# Altium project TAS5828M_Audio_Amp.PrjPcb
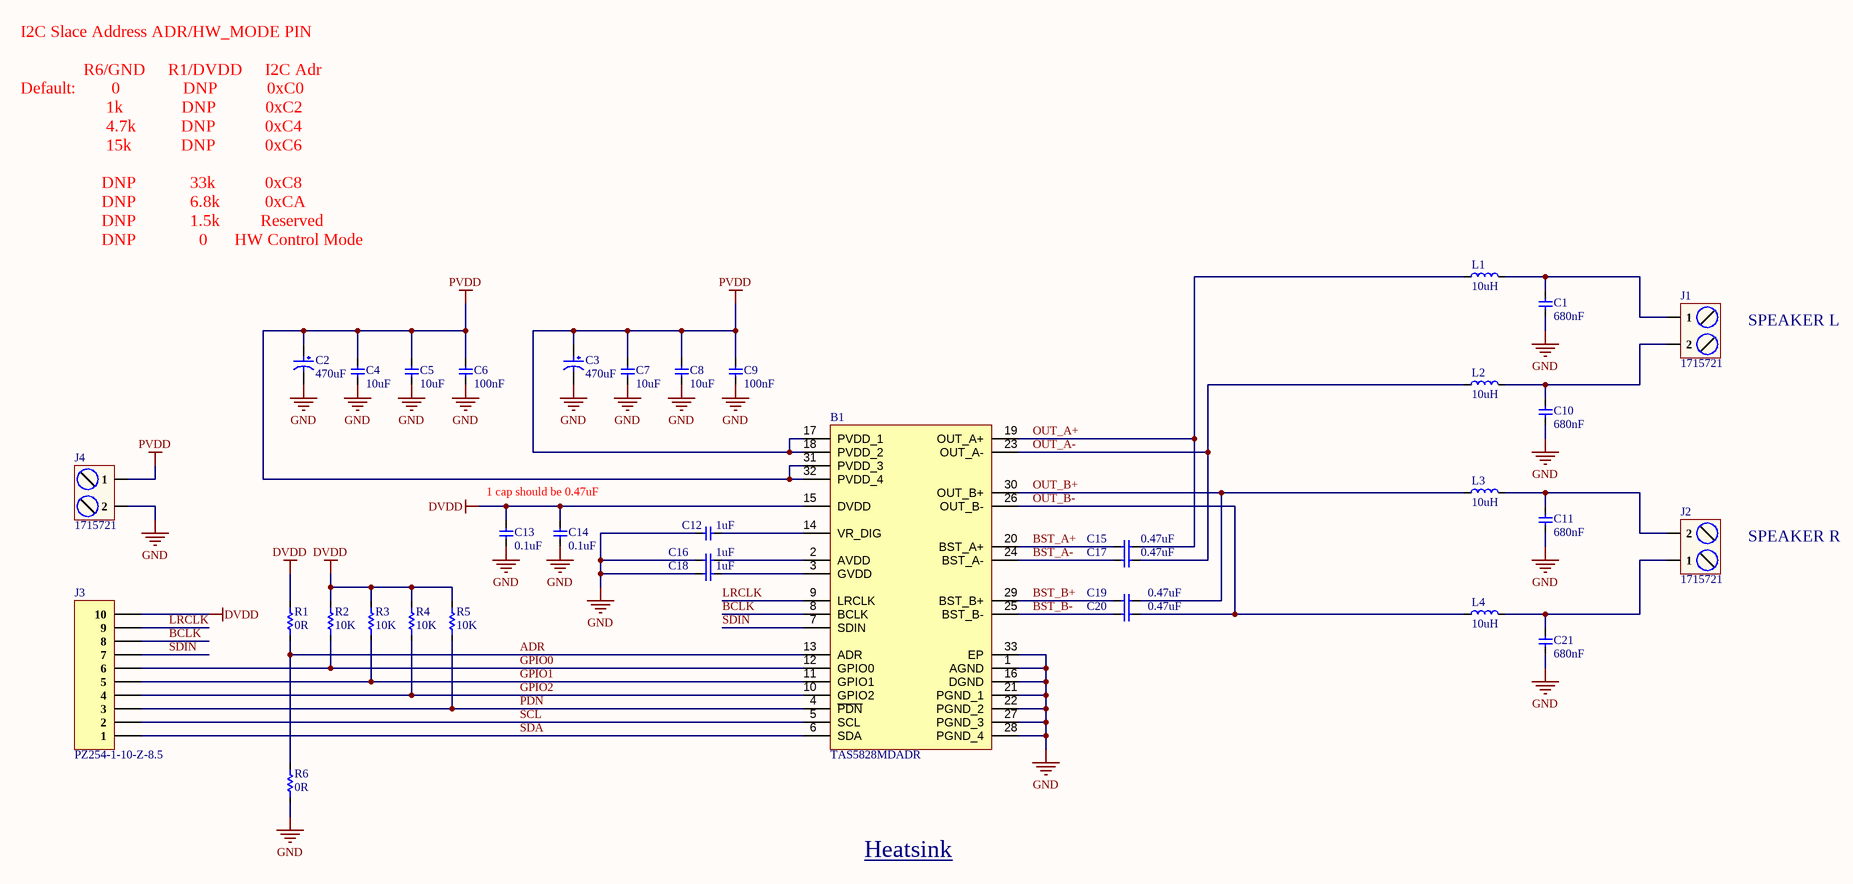
[diagram p0: Sheet1.SchDoc]
1 sheet, 36 parts. Net scope: global (net labels, ports and power ports of the same name join across sheets).
Board file: PCB.PcbDoc

## Sheet Sheet1.SchDoc
size 420 x 297 mm; SheetNumber: 1; SheetTotal: 1

### Parts
B1  TAS5828MDADR  [SOP65P810X115-33M]
C1  680nF  [Cap-0805]
C2  470uF  [RVT470UF50V34RV0133]
C3  470uF  [RVT470UF50V34RV0133]
C4  10uF  [Cap-0805]
C5  10uF  [Cap-0805]
C6  100nF  [Cap-0603]
C7  10uF  [Cap-0805]
C8  10uF  [Cap-0805]
C9  100nF  [Cap-0603]
C10  680nF  [Cap-0805]
C11  680nF  [Cap-0805]
C12  1uF  [Cap-0603]
C13  0.1uF  [Cap-0402]
C14  0.1uF  [Cap-0402]
C15  0.47uF  [Cap-0603]
C16  1uF  [Cap-0603]
C17  0.47uF  [Cap-0603]
C18  1uF  [Cap-0603]
C19  0.47uF  [Cap-0603]
C20  0.47uF  [Cap-0603]
C21  680nF  [Cap-0805]
J1  1715721  [1715721]
J2  1715721  [1715721]
J3  PZ254-1-10-Z-8.5  [PZ254-1-10-Z-8.5]
J4  1715721  [1715721]
L1  10uH  [PSPMAA1040-100M-ANP]
L2  10uH  [PSPMAA1040-100M-ANP]
L3  10uH  [PSPMAA1040-100M-ANP]
L4  10uH  [PSPMAA1040-100M-ANP]
R1  0R  [Res-0402]
R2  10K  [Res-0402]
R3  10K  [Res-0402]
R4  10K  [Res-0402]
R5  10K  [Res-0402]
R6  0R  [Res-0402]

### Nets
DVDD: B1.15(DVDD) C13.2 C14.2 J3.10 R1.2 R2.2 R3.2 R4.2 R5.2
GND: B1.1(AGND) B1.16(DGND) B1.21(PGND_1) B1.22(PGND_2) B1.27(PGND_3) B1.28(PGND_4) B1.33(EP) C1.1 C2.2 C3.2 C4.1 C5.1 C6.1 C7.1 C8.1 C9.1 C10.1 C11.1 C12.1 C13.1 C14.1 C16.1 C18.1 C21.1 J4.2 R6.1
PVDD: B1.17(PVDD_1) B1.18(PVDD_2) B1.31(PVDD_3) B1.32(PVDD_4) C2.1 C3.1 C4.2 C5.2 C6.2 C7.2 C8.2 C9.2 J4.1
ADR: B1.13(ADR) R1.1 R6.2
BCLK: B1.8(BCLK) J3.8
BST_A+: B1.20(BST_A+) C15.1
BST_A-: B1.24(BST_A-) C17.1
BST_B+: B1.29(BST_B+) C19.1
BST_B-: B1.25(BST_B-) C20.1
GPIO0: B1.12(GPIO0) J3.6 R2.1
GPIO1: B1.11(GPIO1) J3.5 R3.1
GPIO2: B1.10(GPIO2) J3.4 R4.1
LRCLK: B1.9(LRCLK) J3.9
OUT_A+: B1.19(OUT_A+) C15.2 L1.1
OUT_A-: B1.23(OUT_A-) C17.2 L2.1
OUT_B+: B1.30(OUT_B+) C19.2 L3.1
OUT_B-: B1.26(OUT_B-) C20.2 L4.1
PDN: B1.4(~{PDN}) J3.3 R5.1
SCL: B1.5(SCL) J3.2
SDA: B1.6(SDA) J3.1
SDIN: B1.7(SDIN) J3.7
NetB1_2: B1.2(AVDD) C16.2
NetB1_3: B1.3(GVDD) C18.2
NetB1_14: B1.14(VR_DIG) C12.2
NetC1_2: C1.2 J1.1 L1.2
NetC10_2: C10.2 J1.2 L2.2
NetC11_2: C11.2 J2.2 L3.2
NetC21_2: C21.2 J2.1 L4.2

### Notes on the sheet
- I2C Slace Address ADR/HW_MODE PIN
  R6/GND     R1/DVDD     I2C Adr
  Default:        0              DNP           0xC0
  1k             DNP           0xC2
  4.7k          DNP           0xC4
  15k           DNP           0xC6
  DNP            33k           0xC8
  DNP            6.8k          0xCA
  DNP            1.5k         Reserved
  DNP              0      HW Control Mode
- SPEAKER L
- 1 cap should be 0.47uF
- SPEAKER R
- Heatsink <https://www.lcsc.com/product-detail/Heat-sink-heatsink_XSD-XSD271-294-B_C286198.html>
- THIS DOCUMENT AND THE DATA DISCLOSED HEREIN OR
- HEREWITH IS THE PROPERTY OF ALTIUM LIMITED AND MAY
- DWG NO:
- REVISION
- REV:
- DESCRIPTION
- DATE
- APPROVED
- BE FREELY DISTRIBUTED IN WHOLE. NO RIGHTS ARE
- RESERVED OR EXPRESS OR IMPLIED WARANTEE GIVEN.
- ENG:
- APPROVALS
- PROJECT
- DSN:
- CHK:
- REFERENCE DOCUMENTS
- PROJECT REVISION:
- TITLE
- DOCUMENT REVISION:
- DESIGN ITEM:
- BOM:
- FAB DWG:
- PCB DWG:
- ASSY DWG:
- SCALE:
- A3
- SIZE
- CAGE CODE
- FILE NAME
- DWG NO.
- SHEET
- OF
- REV

### Library data of the parts
B1 = TAS5828MDADR: Audio Amplifiers 50-W stereo, digital input, high-performance, closed-loop, Class-D, with integrated audio processor 32-HTSSOP -40 to 85; Manufacturer_Name: Texas Instruments; Geometry.Height: 1.15mm; Mouser Part Number: 595-TAS5828MDADR; Mouser Price/Stock: https://www.mouser.co.uk/ProductDetail/Texas-Instruments/TAS5828MDADR?qs=doiCPypUmgHjYs2O7pGN6A%3D%3D; Manufacturer_Part_Number: TAS5828MDADR; Datasheet Link: https://www.ti.com/lit/ds/symlink/tas5828m.pdf; LCSC Part Number: C5214953
C1 C10 C11 C21 = CC0805KKX7R9BB684: 50V 680nF X7R ±10% 0805 Multilayer Ceramic Capacitors MLCC - SMD/SMT ROHS; Manufacturer: YAGEO; Item Type: Cap; Manufacturer Part Number: CC0805KKX7R9BB684; LCSC Part Number: C107133; Package: 0805; ComponentLink1Description: LCSC Link; ComponentLink1URL: https://www.lcsc.com/product-detail/Multilayer-Ceramic-Capacitors-MLCC-SMD-SMT_YAGEO-CC0805KKX7R9BB684_C107133.html
C2 C3 = RVT470UF50V34RV0133: 470uF 50V 50mA@120Hz ±20% SMD,D12.5xL13.5mm Aluminum Electrolytic Capacitors - SMD ROHS; Manufacturer: KNSCHA; Supplier: LCSC; LCSC Part Number: C2837182; Manufacturer Part Number: RVT470UF50V34RV0133; RoHS: No; Item Type: Capacitor
C4 C5 C7 C8 = GRM21BR61H106ME43L: CAP CER 10UF 50V X5R 0805; Manufacturer: Murata; Supplier 1: Digi-Key; Manufacturer Part Number: GRM21BR61H106ME43L; RoHS: Yes; Category: Ceramic Capacitors; Stock 1: 26; Pricing 1: 1=0.44000, 10=0.30700, 50=0.21500, 100=0.18420, 500=0.13818, 1000=0.11668 (USD); Supplier Part Number 1: 490-18664-1-ND; LCSC Part Number: C2190942
C6 C9 = CC0603KRX5R9BB104: CAP CER 0.1UF 50V X5R 0603; Manufacturer: Yageo; Tolerance: 10%; Item Type: Capacitor; Supplier 1: Digi-Key; Manufacturer Part Number: CC0603KRX5R9BB104; RoHS: Yes; Category: Ceramic Capacitors; Stock 1: 152253; Pricing 1: 1=0.10000, 10=0.05200, 50=0.02820, 100=0.02310, 500=0.01648, 1000=0.01294 (USD); Mount: Surface Mount; Case/Package: 0603; Case Code (Imperial): 0603; Case Code (Metric): 1608; Weight: 7.1E-05oz; Min Operating Temperature: -55°C; Max Operating Temperature: 85°C; Capacitance: 100nF; Packaging: Tape and Reel; Voltage Rating: 50V; Dielectric: X5R; Termination: SMD/SMT; Voltage Rating (DC): 50V; Package Quantity: 4000; Length: 0.063inch; Width: 0.031inch; Thickness: 0.035inch; Lead Free: Lead Free; Halogen Free: Halogen Free; ComponentLink1URL: http://www.mouser.com/ds/2/447/Yageo_UPY-GP_NP0_16V-to-50V_9-358835.pdf?src-supplier=Mouser; ComponentLink1Description: http://www.mouser.com/ds/2/447/Yageo_UPY-GP_NP0_16V-to-50V_9-358835.pdf?src-supplier=Mouser; ComponentLink2URL: https://www.yageo.com/upload/media/product/productsearch/datasheet/mlcc/UPY-GPHC_X5R_4V-to-50V_26.pdf?src-supplier=Digi-Key; ComponentLink2Description: https://www.yageo.com/upload/media/product/productsearch/datasheet/mlcc/UPY-GPHC_X5R_4V-to-50V_26.pdf?src-supplier=Digi-Key; ComponentLink3URL: http://www.yageo.com/exep/pages/download/literatures/ProductSelectionGuide%202014_Final_2.pdf?src-supplier=Digi-Key; ComponentLink3Description: http://www.yageo.com/exep/pages/download/literatures/ProductSelectionGuide%202014_Final_2.pdf?src-supplier=Digi-Key; Supplier Part Number 1: 311-4046-1-ND; LCSC Part Number: C110022
C12 C16 C18 = CC0603KRX5R8BB105: CAP CER 1UF 25V X5R 0603; Manufacturer: Yageo; Tolerance: 10%; Item Type: Capacitor; Supplier 1: Digi-Key; Manufacturer Part Number: CC0603KRX5R8BB105; RoHS: Yes; Category: Ceramic Capacitors; Stock 1: 919939; Pricing 1: 1=0.12000, 10=0.08400, 50=0.04760, 100=0.03940, 500=0.02764, 1000=0.02288 (USD); Mount: Surface Mount; Case/Package: 0603; Number of Pins: 2; Case Code (Metric): 1608; Case Code (Imperial): 0603; Min Operating Temperature: -55°C; Max Operating Temperature: 85°C; Capacitance: 1uF; Dielectric: X5R; Package Quantity: 1; Voltage Rating: 25V; Packaging: Tape and Reel; Termination: SMD/SMT; Voltage Rating (DC): 25V; Series: CC; Construction: Flat; Length: 1.6mm; Width: 0.031inch; Height: 0.8mm; Thickness: 0.035inch; Depth: 0.8mm; Radiation Hardening: No; REACH SVHC: No SVHC; Lead Free: Lead Free; Halogen Free: Halogen Free; RoHS Compliant: Yes; ComponentLink1URL: https://datasheet.ciiva.com/176/mlccorderingcode-176785.pdf?src-supplier=Digi-Key; ComponentLink1Description: https://datasheet.ciiva.com/176/mlccorderingcode-176785.pdf?src-supplier=Digi-Key; ComponentLink2URL: https://datasheet.ciiva.com/176/mlccorderingcode-176786.pdf?src-supplier=Digi-Key; ComponentLink2Description: https://datasheet.ciiva.com/176/mlccorderingcode-176786.pdf?src-supplier=Digi-Key; ComponentLink3URL: https://datasheet.ciiva.com/176/mlccorderingcode-176787.pdf?src-supplier=Digi-Key; ComponentLink3Description: https://datasheet.ciiva.com/176/mlccorderingcode-176787.pdf?src-supplier=Digi-Key; ComponentLink4URL: https://datasheet.ciiva.com/17436/upy-gphc-x5r-4v-to-50v-12-17436952.pdf?src-supplier=Avnet+Europe; ComponentLink4Description: https://datasheet.ciiva.com/17436/upy-gphc-x5r-4v-to-50v-12-17436952.pdf?src-supplier=Avnet+Europe; ComponentLink5URL: https://datasheet.ciiva.com/7978/1525783-7978171.pdf?src-supplier=Element14; ComponentLink5Description: https://datasheet.ciiva.com/7978/1525783-7978171.pdf?src-supplier=Element14; ComponentLink6URL: https://datasheet.ciiva.com/11586/upy-gphc-x5r-4v-to-50v-12-11586318.pdf?src-supplier=Avnet; ComponentLink6Description: https://datasheet.ciiva.com/11586/upy-gphc-x5r-4v-to-50v-12-11586318.pdf?src-supplier=Avnet; Supplier Part Number 1: 311-1445-1-ND; LCSC Part Number: C14664
C13 C14 = CC0402JRX7R7BB104: CAP CER 0.1UF 16V X7R 0402; Manufacturer: Yageo; Material: 4241ConductorMaterial; Value: 100nF; Tolerance: 5%; Item Type: Capacitor; Supplier: Digikey; Supplier Part Number: 311-1676-1-ND; Manufacturer Part Number: CC0402JRX7R7BB104; RoHS: Yes; Category: Ceramic Capacitors; Stock: 1659111; Pricing: 1=0.1, 10=0.046, 50=0.0262, 100=0.0203, 500=0.01528, 1000=0.012, 2500=0.01091, 5000=0.01004 (USD); Mounting Technology: Surface Mount; Case/Package: 0402; Case Code (Metric): 1005; Case Code (Imperial): 0402; Min Operating Temperature: -55°C; Max Operating Temperature: 125°C; Dielectric: X7R; Packaging: Tape and Reel; Package Quantity: 10000; Voltage Rating (DC): 16V; Voltage Rating: 16V; Series: CC; Construction: Flat; Length: 0.039inch; Width: 0.02inch; Height: 0.5mm; Thickness: 0.022inch; Lead Free: Lead Free; Halogen Free: Halogen Free; RoHS Compliant: Yes; ComponentLink1URL: https://datasheet.ciiva.com/13210/upy-gphc-x7r-6-3v-to-50v-8-12304-13210152.pdf?src-supplier=Mouser; ComponentLink1Description: https://datasheet.ciiva.com/13210/upy-gphc-x7r-6-3v-to-50v-8-12304-13210152.pdf?src-supplier=Mouser; LCSC Part Number: C541464
C15 C17 C19 C20 = CC0603KRX5R9BB474: CAP CER 0.47UF 50V X5R 0603; Manufacturer: Yageo; Capacitance: 470nF; Tolerance: 10%; Item Type: Capacitor; Supplier 1: Digi-Key; Manufacturer Part Number: CC0603KRX5R9BB474; RoHS: Yes; Category: Ceramic Capacitors; Stock 1: 15145; Pricing 1: 1=0.45000, 10=0.31400, 50=0.22000, 100=0.18860, 500=0.14144, 1000=0.11944 (USD); Mount: Surface Mount; Case/Package: 0603; Min Operating Temperature: -55°C; Max Operating Temperature: 85°C; Packaging: Tape and Reel; Voltage Rating: 50V; Voltage Rating (DC): 50V; Dielectric: X5R; Length: 0.063inch; Width: 0.031inch; Thickness: 0.035inch; Lead Free: Lead Free; Halogen Free: Halogen Free; RoHS Compliant: Yes; ComponentLink1URL: https://www.mouser.com/ds/2/447/ProductSelectionGuide 2014_Final_2-1131690.pdf?src-supplier=Mouser; ComponentLink1Description: https://www.mouser.com/ds/2/447/ProductSelectionGuide 2014_Final_2-1131690.pdf?src-supplier=Mouser; ComponentLink2URL: http://www.yageo.com/documents/recent/UPY-GPHC_X5R_4V-to-50V_25.pdf?src-supplier=Digi-Key; ComponentLink2Description: http://www.yageo.com/documents/recent/UPY-GPHC_X5R_4V-to-50V_25.pdf?src-supplier=Digi-Key; ComponentLink3URL: http://www.yageo.com/exep/pages/download/literatures/ProductSelectionGuide%202014_Final_2.pdf?src-supplier=Digi-Key; ComponentLink3Description: http://www.yageo.com/exep/pages/download/literatures/ProductSelectionGuide%202014_Final_2.pdf?src-supplier=Digi-Key; Supplier Part Number 1: 311-4047-1-ND; LCSC Part Number: C513651
J1 J2 J4 = 1715721: TERM BLK 2P SIDE ENT 5.08MM PCB; Manufacturer: Phoenix Contact; Item Type: Terminal Blocks; Supplier: Digikey; Supplier Part Number: 277-1263-ND; Manufacturer Part Number: 1715721; RoHS: Yes; Stock: 13160; Pricing: 1=0.94 (USD); ComponentLink1URL: https://datasheet.ciiva.com/1120/1697161-1120393.pdf?src-supplier=Farnell; ComponentLink1Description: https://datasheet.ciiva.com/1120/1697161-1120393.pdf?src-supplier=Farnell; ComponentLink2URL: https://datasheet.ciiva.com/832/1715721-832095.pdf?src-supplier=Digikey; ComponentLink2Description: https://datasheet.ciiva.com/832/1715721-832095.pdf?src-supplier=Digikey; ComponentLink3URL: https://datasheet.ciiva.com/15169/getdatasheetpartid-212174-15169929.pdf?src-supplier=Verical; ComponentLink3Description: https://datasheet.ciiva.com/15169/getdatasheetpartid-212174-15169929.pdf?src-supplier=Verical; ComponentLink4URL: https://datasheet.ciiva.com/16046/1715721-16046034.pdf?src-supplier=Onlinecomponents.com; ComponentLink4Description: https://datasheet.ciiva.com/16046/1715721-16046034.pdf?src-supplier=Onlinecomponents.com; LCSC Part Number: C480516
J3 = PZ254-1-10-Z-8.5: 3A Direct Insert Policy 2.5mm 260℃@10S 10P 6mm -40℃~+105℃ 3mm 2.54mm Single Row Black Brass 1x10P Plugin,P=2.54mm Pin Headers ROHS; Manufacturer: HCTL; Item Type: Header; Manufacturer Part Number: PZ254-1-10-Z-8.5; LCSC Part Number: C2894933; Package: Plugin,P=2.54mmPlugin,P=2.54mm; ComponentLink1Description: LCSC Link; ComponentLink1URL: https://www.lcsc.com/product-detail/Pin-Headers_HCTL-PZ254-1-10-Z-8-5_C2894933.html
L1-L4 = PSPMAA1040-100M-ANP: 7A 10uH ±20% 10A SMD,10.3x10.5mm Power Inductors ROHS; Manufacturer: PROD Tech; Manufacturer Part Number: PSPMAA1040-100M-ANP; Package: SMD,10.3x10.5mm; LCSC Part Number: C2983105; Item Type: Inductor; ComponentLink1Description: LCSC; ComponentLink1URL: https://www.lcsc.com/product-detail/Power-Inductors_PROD-Tech-PSPMAA1040-100M-ANP_C2983105.html
R1 R6 = RC0402FR-070RL: RES 0 OHM JUMPER 1/16W 0402; Manufacturer: Yageo; Item Type: Resistors; Tolerance: 1%; Power Rating: 62.5mW; Voltage Rating: 50V; Temperature Coefficient: 200ppm/°C; Max Power Dissipation: 63mW; Supplier 1: Mouser; Manufacturer Part Number: RC0402FR-070RL; RoHS: Yes; Stock 1: 8556842; Pricing 1: 1=0.10000, 10=0.01400, 50=0.01400, 100=0.00600, 1000=0.00300, 5000=0.00200, 10000=0.00100 (USD); Mount: Surface Mount; Case/Package: 0402; Contact Plating: Tin,Matte; Case Code (Imperial): 0402; Case Code (Metric): 1005; Size Code: 0402; Min Operating Temperature: -55°C; Max Operating Temperature: 155°C; Resistance: 0R; Resistor Type: Thick Film; Packaging: Tape and Reel; Termination: SMD/SMT; Features: Moisture Resistant; Series: RC; Number of Terminations: 2; Length: 1mm; Width: 0.5mm; Height: 0.35mm; Radiation Hardening: No; Lead Free: Lead Free; RoHS Compliant: Yes; ComponentLink1URL: https://datasheet.ciiva.com/8896/pyu-rc0402-51-rohs-l-6-8896149.pdf?src-supplier=Avnet; ComponentLink1Description: https://datasheet.ciiva.com/8896/pyu-rc0402-51-rohs-l-6-8896149.pdf?src-supplier=Avnet; ComponentLink2URL: https://datasheet.ciiva.com/16790/pyu-rc0402-51-rohs-l-6-r-16790444.pdf?src-supplier=Future+Electronics; ComponentLink2Description: https://datasheet.ciiva.com/16790/pyu-rc0402-51-rohs-l-6-r-16790444.pdf?src-supplier=Future+Electronics; Supplier Part Number 1: 603-RC0402FR-070RL; LCSC Part Number: C106231
R2-R5 = RC0402FR-0710KL: RES 10K OHM 1% 1/16W 0402; Manufacturer: Yageo; Resistance: 10kR; Voltage Rating (DC): 50V; Temperature Coefficient: 100ppm/°C; Power Rating: 62.5mW; Max Power Dissipation: 63mW; Item Type: Resistor; Supplier 1: Mouser; Manufacturer Part Number: RC0402FR-0710KL; RoHS: Yes; Category: Chip SMD Resistors; Stock 1: 18648329; Pricing 1: 1=0.10000, 10=0.01400, 50=0.01400, 100=0.00500, 1000=0.00300, 10000=0.00200 (USD); Case/Package: 0402; Number of Pins: 2; Case Code (Imperial): 0402; Case Code (Metric): 1005; Min Operating Temperature: -55°C; Max Operating Temperature: 155°C; Resistor Type: Thick Film; Tolerance: 1%; Packaging: Tape and Reel; Voltage Rating: 50V; Termination: SMD/SMT; Working Voltage: 50V; Number of Terminations: 2; Features: Moisture Resistant; Series: RC; Resistance Tolerance: 1%; Construction: Rectangular; Length: 1mm; Width: 0.5mm; Height: 0.32mm; Depth: 0.5mm; Lead Pitch: 0.2mm; REACH SVHC: No SVHC; Lead Free: Lead Free; RoHS Compliant: Yes; Military Standard: Not; ComponentLink1URL: https://datasheet.ciiva.com/7660/38568-7660787.pdf?src-supplier=Element14; ComponentLink1Description: https://datasheet.ciiva.com/7660/38568-7660787.pdf?src-supplier=Element14; ComponentLink2URL: https://datasheet.ciiva.com/7849/1686128-7849814.pdf?src-supplier=Element14; ComponentLink2Description: https://datasheet.ciiva.com/7849/1686128-7849814.pdf?src-supplier=Element14; ComponentLink3URL: https://datasheet.ciiva.com/7983/1018594-7983486.pdf?src-supplier=Element14; ComponentLink3Description: https://datasheet.ciiva.com/7983/1018594-7983486.pdf?src-supplier=Element14; ComponentLink4URL: https://datasheet.ciiva.com/22747/1018594-22747512.pdf?src-supplier=Element14; ComponentLink4Description: https://datasheet.ciiva.com/22747/1018594-22747512.pdf?src-supplier=Element14; ComponentLink5URL: https://datasheet.ciiva.com/12667/pyu-rc0402-51-rohs-l-6-r-12667067.pdf?src-supplier=Mouser; ComponentLink5Description: https://datasheet.ciiva.com/12667/pyu-rc0402-51-rohs-l-6-r-12667067.pdf?src-supplier=Mouser; ComponentLink6URL: https://datasheet.ciiva.com/7849/1784430-7849813.pdf?src-supplier=Element14; ComponentLink6Description: https://datasheet.ciiva.com/7849/1784430-7849813.pdf?src-supplier=Element14; ComponentLink7URL: https://datasheet.ciiva.com/7849/1784430-7849815.pdf?src-supplier=Element14; ComponentLink7Description: https://datasheet.ciiva.com/7849/1784430-7849815.pdf?src-supplier=Element14; Supplier Part Number 1: 603-RC0402FR-0710KL; LCSC Part Number: C60490